# Altium project AdamPannel.PrjPcb
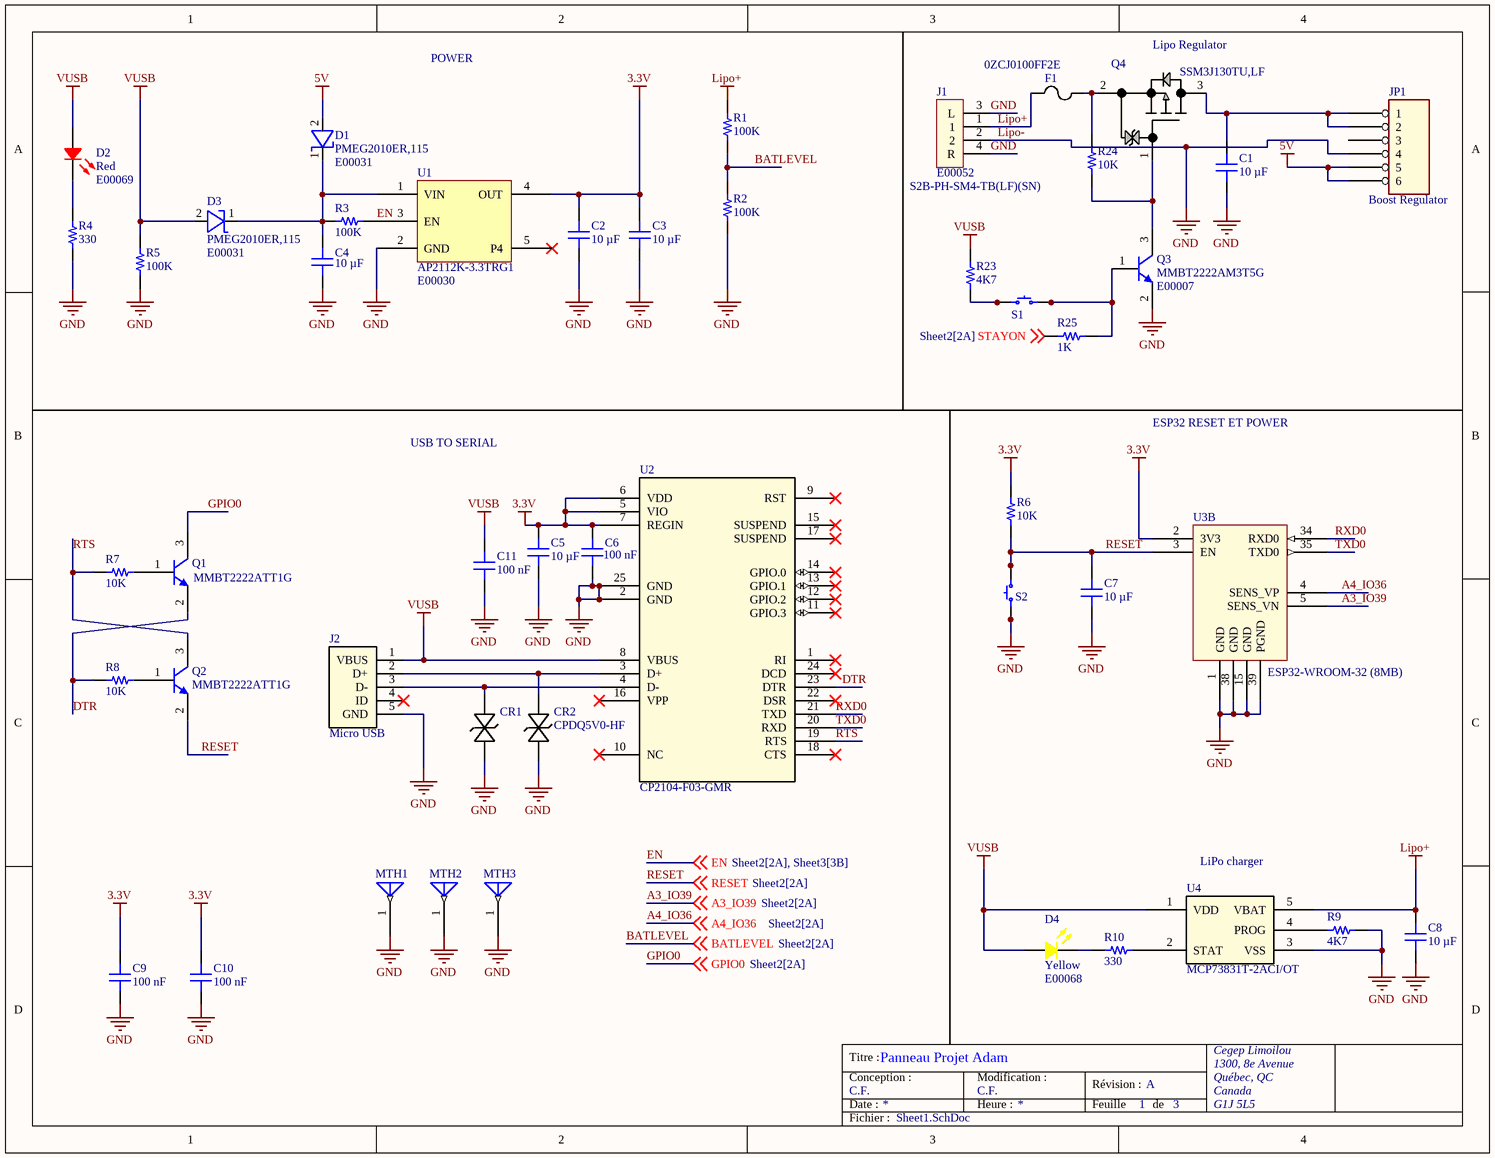
[diagram p0: Sheet1.SchDoc]
3 sheets, 89 parts. Net scope: global (net labels, ports and power ports of the same name join across sheets).
Board file: AdamPannel.PcbDoc
Sheets:
  Sheet1.SchDoc
  Sheet2.SchDoc
  Sheet3.SchDoc

## Sheet Sheet1.SchDoc: Panneau Projet Adam
size Letter; Author: Camille Fortin; CompanyName: Cegep Limoilou; Organization: Cegep Limoilou; Address1: 1300, 8e Avenue; Address2: Québec, QC; Address3: Canada; Address4: G1J 5L5; Revision: A; SheetNumber: 1; SheetTotal: 3; Conception: C.F.; Titre: Panneau Projet Adam; Modification: C.F.

### Parts
C1  10 µF  [CAP 0603]
C2  10 µF  [CAP 0603]
C3  10 µF  [CAP 0603]
C4  10 µF  [CAP 0603]
C5  10 µF  [CAP 0603]
C6  100 nF  [CAP 0603]
C7  10 µF  [CAP 0603]
C8  10 µF  [CAP 0603]
C9  100 nF  [CAP 0603]
C10  100 nF  [CAP 0603]
C11  100 nF  [CAP 0603]
CR1  CPDQ5V0-HF  [CPDQ-M]  (value not drawn)
CR2  CPDQ5V0-HF  [CPDQ-M]
D1  PMEG2010ER,115  ADAM Inventory Number 1: E00031  [DIODE_PMEG2010ER,115_NEX]
D2  Red  ADAM Inventory Number 1: E00069  [Red Led 0603]
D3  PMEG2010ER,115  ADAM Inventory Number 1: E00031  [DIODE_PMEG2010ER,115_NEX]
D4  Yellow  ADAM Inventory Number 1: E00068  [YELLOW LED 0603 - duplicate]
F1  0ZCJ0100FF2E  [Fuse 500mA 0.6mm]
J1  ADAM Inventory Number 1: E00052  Supplier Part Number 1: S2B-PH-SM4-TB(LF)(SN)  [S2B-PH-SM4-TB_LF__SN]  (hidden comment: CONN JST 2P SM 90DEG)
J2  Micro USB  [CONN_1050170001_MOL]
JP1  Boost Regulator  [HDR1X6]
MTH1  NTENNA  [Mounting Hole]  (value not drawn)
MTH2  ANTENNA  [Mounting Hole]  (value not drawn)
MTH3  ANTENNA  [Mounting Hole]  (value not drawn)
Q1  MMBT2222ATT1G  [SOT-416_1P65X0P9_ONS-M]
Q2  MMBT2222ATT1G  [SOT-416_1P65X0P9_ONS-M]
Q3  MMBT2222AM3T5G  ADAM Inventory Number 1: E00007  [SOT_4C-E3-08_VIS-M]
Q4  SSM3J130TU,LF  [UFM_TOS]
R1  100K  [RES 0603]
R2  100K  [RES 0603]
R3  100K  [RES 0603]
R4  330  [RES 0603]
R5  100K  [RES 0603]
R6  10K  [RES 0603]
R7  10K  [RES 0603]
R8  10K  [RES 0603]
R9  4K7  [RES 0603]
R10  330  [RES 0603]
R23  4K7  [RES 0603]
R24  10K  [RES 0603]
R25  1K  [RES 0603]
S1  KMR741NG ULC LFS  [Switch Lin SMD]  (value not drawn)
S2  KMR741NG ULC LFS  [Switch Lin SMD]  (value not drawn)
U1  AP2112K-3.3TRG1  ADAM Inventory Number 1: E00030  [AP2112R5-3.3TRG1_DIO]
U2  CP2104-F03-GMR  [QFN_F03-GMR_SIL-M]
U3  ESP32-WROOM-32 (8MB)  [ESP32-WROOM-32D]  (part B of 3)
U4  MCP73831T-2ACI/OT  [SOT23_MCP73831T-2ACI/OT_HNW]

### Nets
3.3V: C2.2 C3.2 C5.2 C6.2 C9.2 C10.2 R6.2 U1.4(OUT) U2.5(VIO) U2.6(VDD) U2.7(REGIN) U3.2(3V3)
5V: D1.2(A) JP1.5 JP1.6
GND: C1.1 C2.1 C3.1 C4.1 C5.1 C6.1 C7.1 C8.1 C9.1 C10.1 C11.1 CR1.1 CR2.1 J1.2 J1.3(L) J1.4(R) J2.5(GND) JP1.4 MTH1.1 MTH2.1 MTH3.1 Q3.2(E) R2.1 R4.2 R5.1 R9.2 S2.1 S2.2 U1.2(GND) U2.2(GND) U2.25(GND) U3.1(GND) U3.15(GND) U3.38(GND) U3.39(PGND) U4.3(VSS)  [also labelled Lipo-]
Lipo+: C8.2 F1.1 J1.1 R1.2 U4.5(VBAT)
VUSB: C11.2 D2.1 D3.2(A) D4.1 J2.1(VBUS) R5.2 R23.2 U2.8(VBUS) U4.1(VDD)
A3_IO39: U3.5(SENS_VN) ; off-sheet A3_IO39
A4_IO36: U3.4(SENS_VP) ; off-sheet A4_IO36
BATLEVEL: R1.1 R2.2 ; off-sheet BATLEVEL
DTR: Q1.2(E) R8.2 U2.23(DTR)
EN: R3.1 U1.3(EN) ; off-sheet EN
GPIO0: Q1.3(C) ; off-sheet GPIO0
RESET: C7.2 Q2.2(E) R6.1 S2.3 S2.4 U3.3(EN) ; off-sheet RESET
RTS: Q2.3(C) R7.2 U2.19(RTS)
RXD0: U2.21(TXD) U3.34(RXD0)
STAYON: R25.2 ; off-sheet STAYON
TXD0: U2.20(RXD) U3.35(TXD0)
NetC1_2: C1.2 JP1.1 JP1.2 Q4.3
NetC4_2: C4.2 D1.1(K) D3.1(K) R3.2 U1.1(VIN)
NetCR1_2: CR1.2 J2.3(D-) U2.4(D-)
NetCR2_2: CR2.2 J2.2(D+) U2.3(D+)
NetD2_2: D2.2 R4.1
NetD4_2: D4.2 R10.1
NetF1_2: F1.2 Q4.2 R24.2
NetQ1_1: Q1.1(B) R7.1
NetQ2_1: Q2.1(B) R8.1
NetQ3_1: Q3.1(B) R25.1 S1.3 S1.4
NetQ3_3: Q3.3(C) Q4.1 R24.1
NetR9_1: R9.1 U4.4(PROG)
NetR10_2: R10.2 U4.2(STAT)
NetR23_1: R23.1 S1.1 S1.2

Not connected (* = marked no-connect by the designer): J2 4(ID)*; JP1 3; U1 5(P4)*; U2 1(RI)* 9(RST)* 10(NC)* 11(GPIO.3)* 12(GPIO.2)* 13(GPIO.1)* 14(GPIO.0)* 15(SUSPEND)* 16(VPP)* 17(SUSPEND)* 18(CTS)* 22(DSR)* 24(DCD)*

### Notes on the sheet
- POWER
- (near Q4) Lipo Regulator
- ESP32 RESET ET POWER
- USB TO SERIAL
- (near U4) LiPo charger
- Titre :
- Conception :
- Date :
- Modification :
- Heure :
- Révision :
- Feuille
- de
- Fichier :

### Library data of the parts
C1-C5 C7 C8 = GRM188C81A106MA73D: CAP CER 10UF 10V X6S 0603; manufacturer: Murata Electronics; Tolerance: ±20%; Part Number: GRM188C81A106MA73D; Value: 10 µF; Applications: General Purpose; Capacitance: 10 µF; componentlink1description: Datasheet; componentlink1url: https://www.murata.com/~/media/webrenewal/support/library/catalog/products/capacitor/mlcc/c02e.ashx?la=en-us; componentlink2description: DigiKey Link; componentlink2url: https://www.digikey.com/en/products/detail/murata-electronics/GRM188C81A106MA73D/3900461; Device Package: 0603 (1608 Metric); lastupdated: 2023-03-27 19:07:26; Lifecycle Status: Active; Minimum Order: 1; Mounting Type: Surface Mount, MLCC; Operating Temperature: -55°C ~ 105°C; Package / Case: 0603 (1608 Metric); packaging: TapeAndReel; partid: 2456; Part Status: Active; price: 0.04; series: GRM; Size / Dimension: 0.063" L x 0.031" W (1.60mm x 0.80mm); Supplier 1: DigiKey; Supplier Part Number 1: 490-7197-1-ND; Temperature Coefficient: X6S; Thickness (Max): 0.039" (1.00mm); Voltage - Rated: 10V; Manufacturer Part Number 1: GRM188C81A106MA73D
C6 C9-C11 = GRM188C81A106MA73D: CAP CER 10UF 10V X6S 0603; manufacturer: Murata Electronics; Capacitance: 10 µF; Tolerance: ±20%; Part Number: GRM188C81A106MA73D; Value: 100 nF; Applications: General Purpose; componentlink1description: Datasheet; componentlink1url: https://www.murata.com/~/media/webrenewal/support/library/catalog/products/capacitor/mlcc/c02e.ashx?la=en-us; componentlink2description: DigiKey Link; componentlink2url: https://www.digikey.com/en/products/detail/murata-electronics/GRM188C81A106MA73D/3900461; Device Package: 0603 (1608 Metric); lastupdated: 2023-03-27 19:07:26; Lifecycle Status: Active; Minimum Order: 1; Mounting Type: Surface Mount, MLCC; Operating Temperature: -55°C ~ 105°C; Package / Case: 0603 (1608 Metric); packaging: TapeAndReel; partid: 2456; Part Status: Active; price: 0.04; series: GRM; Size / Dimension: 0.063" L x 0.031" W (1.60mm x 0.80mm); Supplier 1: DigiKey; Supplier Part Number 1: 490-7197-1-ND; Temperature Coefficient: X6S; Thickness (Max): 0.039" (1.00mm); Voltage - Rated: 10V; Manufacturer Part Number 1: GRM188C81A106MA73D
CR1 CR2 = CPDQ5V0-HF: Diode TVS bidirectionnel; Mfr_Name: Comchip
D1 D3 = PMEG2010ER,115: Diode shotkey; Manufacturer Part Number 1: PMEG2010ER115; Supplier 1: Digi-Key; Supplier Part Number 1: 1727-5192-1-ND
D2 = 0603 RED LED: Manufacturer Part Number 1: BL-HUB36A-AV-TRB; Manufacturer: American Bright Optoelectronics Corporation; Configuration: Standard; Current - Test: 20mA; Lens Color: Colorless; Lens Style: Rectangle with Flat Top; Lens Transparency: Clear; Millicandela Rating: 94mcd; Viewing Angle: 120°; Voltage - Forward (Vf) (Typ): 2.2V; Wavelength - Dominant: 632nm; Wavelength - Peak: 645nm; Color: Red; ComponentLink1Description: Datasheet; ComponentLink1URL: https://americanbrightled.com/pdffiles/smt/BL-HUB36A-AV-TRB.pdf; ComponentLink2Description: DigiKey Link; ComponentLink2URL: https://www.digikey.com/en/products/detail/american-bright-optoelectronics-corporation/BL-HUB36A-AV-TRB/9678174; Device Package: 0603 (1608 Metric); Height (Max): 0.70mm; LastUpdated: 2023-03-27 19:53:19; Lifecycle Status: Active; Minimum Order: 1; Mounting Type: Surface Mount; Package / Case: 0603 (1608 Metric); Packaging: TapeAndReel; PartId: 1020; Part Status: Active; Price: 0.04; Series: -; Size / Dimension: 1.60mm L x 0.80mm W; Supplier 1: DigiKey; Supplier Part Number 1: BL-HUB36A-AV-TRBCT-ND; Supplier Device Package: 0603; Value: Red
D4 = 0603 YELLOW LED: 0603 YELLOW; Manufacturer Part Number 1: BL-HKC36D-AV-TRB; Manufacturer: American Bright Optoelectronics Corporation; Configuration: 0603; Current - Test: 20mA; Lens Color: Colorless; Lens Size: 0.87mm x 0.80mm; Lens Style: Rectangle with Flat Top; Lens Transparency: Clear; Millicandela Rating: 120mcd; Viewing Angle: 120°; Voltage - Forward (Vf) (Typ): 2V; Wavelength - Dominant: 589nm; Wavelength - Peak: 590nm; Color: Yellow; ComponentLink1Description: Datasheet; ComponentLink1URL: http://americanbrightled.com/pdffiles/smt/BL-HKC36D-AV-TRB.pdf; ComponentLink2Description: DigiKey Link; ComponentLink2URL: https://www.digikey.com/en/products/detail/american-bright-optoelectronics-corporation/BL-HKC36D-AV-TRB/9678175; Device Package: 0603 (1608 Metric); Height (Max): 0.85mm; LastUpdated: 2023-03-27 19:54:01; Lifecycle Status: Active; Minimum Order: 1; Mounting Type: Surface Mount; Package / Case: 0603 (1608 Metric); Packaging: TapeAndReel; PartId: 82; Part Status: Active; Price: 0.04; Series: -; Size / Dimension: 1.60mm L x 0.80mm W; Supplier 1: DigiKey; Supplier Part Number 1: BL-HKC36D-AV-TRBCT-ND; Supplier Device Package: 0603; Value: Yellow
F1 = NANOSMDCH030F/24-02: No Description Available; Mfr_Name: Littelfuse Inc
J1 = CONN JST 2P SM 90DEG: CONN SM JST 2P; Copyright: Copyright (C) 2023 Ultra Librarian. All rights reserved.; Mfr_Name: JST; Manufacturer Part Number 1: S2B-PH-SM4-TB(LF)(SN); RefDes: RefDes; Type: DEV; Supplier 1: Arrow Electronics; Parameter 1: *
J2 = 1050170001: No Description Available; Mfr_Name: Molex Connector Corporation; Copyright: Copyright (C) 2023 Ultra Librarian. All rights reserved.; RefDes: RefDes; Type: DEV; Manufacturer Part Number 1: 1050170001
JP1 = HEADER 6
MTH1 = ANTENNA
Q1 Q2 = MMBT2222ATT1G: TRANS NPN 40V 0.6A SC75-3; Manufacturer: ON Semiconductor; Current - Collector (Ic) (Max): 600mA; DC Current Gain (hFE) (Min) @ Ic, Vce: 100 @ 150mA, 10V; Frequency - Transition: 300MHz; Power - Max: 150mW; Vce Saturation (Max) @ Ib, Ic: 1V @ 50mA, 500mA; Part Number: MMBT2222ATT1G; ComponentLink1Description: Datasheet; ComponentLink1URL: http://www.onsemi.com/pub/Collateral/MMBT2222ATT1-D.PDF; ComponentLink2Description: DigiKey Link; ComponentLink2URL: http://digikey.com/product-detail/en/on-semiconductor/MMBT2222ATT1G/MMBT2222ATT1GOSCT-ND/1967146; LastUpdated: 2023-03-27 20:07:05; Lifecycle Status: Active; Minimum Order: 1; Mounting Type: Surface Mount; Operating Temperature: -55°C ~ 150°C (TJ); Package / Case: SC-75, SOT-416; Packaging: TapeAndReel; PartId: 32; Part Status: Active; Price: 0.02; Series: -; Supplier 1: DigiKey; Supplier Part Number 1: MMBT2222ATT1GOSCT-ND; Supplier Device Package: SC-75, SOT-416; Transistor Type: NPN; Voltage - Collector Emitter Breakdown (Max): 40V; Manufacturer Part Number 1: MMBT2222ATT1G
Q3 = TRANS NPN 40V: TRANS NPN 40V 0.6A SOT-723; Manufacturer: ON Semiconductor; Current - Collector Cutoff (Max): 10nA (ICBO); Current - Collector (Ic) (Max): 600mA; DC Current Gain (hFE) (Min) @ Ic, Vce: 100 @ 150mA, 10V; Frequency - Transition: 300MHz; Power - Max: 640mW; Vce Saturation (Max) @ Ib, Ic: 1V @ 50mA, 500mA; Manufacturer Part Number 1: MMBT2222AM3T5G; ComponentLink1Description: Datasheet; ComponentLink1URL: http://www.onsemi.com/pub/Collateral/MMBT2222AM3-D.PDF; ComponentLink2Description: DigiKey Link; ComponentLink2URL: http://digikey.com/product-detail/en/on-semiconductor/MMBT2222AM3T5G/MMBT2222AM3T5GOSCT-ND/3487571; LastUpdated: 2023-03-28 20:16:11; Lifecycle Status: Active; Minimum Order: 1; Mounting Type: Surface Mount; Operating Temperature: -55°C ~ 150°C (TJ); Package / Case: SOT-723; Packaging: TapeAndReel; PartId: 22; Part Status: Active; Price: 0.03; Series: -; Supplier 1: DigiKey; Supplier Part Number 1: MMBT2222AM3T5GOSCT-ND; Supplier Device Package: SOT-723; Transistor Type: NPN; Voltage - Collector Emitter Breakdown (Max): 40V
Q4 = SSM3J130TU,LF: No Description Available; Mfr_Name: Toshiba Electronic Devices & Storage Corp.; RefDes: Refdes; Type: Type
R1-R3 R5 R23-R25 = CPF0603B100KE: RES SMD 100K OHM 0.1% 1/16W 0603; Manufacturer: TE Connectivity Passive Product; Power (Watts): 0.063W, 1/16W; Resistance: 100 kOhms; Temperature Coefficient: ±25ppm/°C; Part Number: CPF0603B100KE; ComponentLink1Description: Datasheet; ComponentLink1URL: https://www.te.com/commerce/DocumentDelivery/DDEController?Action=srchrtrv&DocNm=1773200&DocType=DS&DocLang=English; ComponentLink2Description: DigiKey Link; ComponentLink2URL: https://www.digikey.com/en/products/detail/te-connectivity-passive-product/CPF0603B100KE/2381864; Composition: Thin Film; Device Package: 0603 (1608 Metric); Height - Seated (Max): 0.022" (0.55mm); LastUpdated: 2023-03-22 19:30:13; Lifecycle Status: Active; Minimum Order: 1; Number of Terminations: 2; Operating Temperature: -55°C ~ 155°C; Package / Case: 0603 (1608 Metric); Packaging: TapeAndReel; PartId: 4883; Part Status: Active; Price: 0.09; Series: CPF, Neohm; Size / Dimension: 0.061" L x 0.031" W (1.55mm x 0.80mm); Supplier 1: DigiKey; Supplier Part Number 1: A119912CT-ND; Supplier Device Package: 0603; Tolerance: ±0.1%; Manufacturer Part Number 1: CPF0603B100KE
  R1-R3 R5: Value: 100K
  R23: Value: 4K7
  R24: Value: 10K
  R25: Value: 1K
R4 R10 = CPF0603B1K0E: RES SMD 1K OHM 0.1% 1/16W 0603; Manufacturer: TE Connectivity Passive Product; Power (Watts): 0.063W, 1/16W; Resistance: 1 kOhms; Temperature Coefficient: ±25ppm/°C; Part Number: CPF0603B1K0E; Value: 330; ComponentLink1Description: Datasheet; ComponentLink1URL: https://www.te.com/commerce/DocumentDelivery/DDEController?Action=srchrtrv&DocNm=1773200&DocType=DS&DocLang=English; ComponentLink2Description: DigiKey Link; ComponentLink2URL: https://www.digikey.com/en/products/detail/te-connectivity-passive-product/CPF0603B1K0E/2390473; Composition: Thin Film; Device Package: 0603 (1608 Metric); Height - Seated (Max): 0.022" (0.55mm); LastUpdated: 2023-03-28 19:30:06; Lifecycle Status: Active; Minimum Order: 1; Number of Terminations: 2; Operating Temperature: -55°C ~ 155°C; Package / Case: 0603 (1608 Metric); Packaging: TapeAndReel; PartId: 4877; Part Status: Active; Price: 0.09; Series: CPF, Neohm; Size / Dimension: 0.061" L x 0.031" W (1.55mm x 0.80mm); Supplier 1: DigiKey; Supplier Part Number 1: A119887CT-ND; Supplier Device Package: 0603; Tolerance: ±0.1%; Manufacturer Part Number 1: CPF0603B1K0E
R6-R8 = RNCS0603BKE10K0: RES 10K OHM 0.1% 1/16W 0603; Manufacturer: Stackpole Electronics Inc; Power (Watts): 0.063W, 1/16W; Resistance: 10 kOhms; Temperature Coefficient: ±25ppm/°C; Part Number: RNCS0603BKE10K0; Value: 10K; ComponentLink1Description: Datasheet; ComponentLink1URL: https://www.seielect.com/catalog/sei-rncs_rnch.pdf; ComponentLink2Description: DigiKey Link; ComponentLink2URL: https://www.digikey.com/en/products/detail/stackpole-electronics-inc/RNCS0603BKE10K0/1708836; Composition: Thin Film; Device Package: 0603 (1608 Metric); Features: Anti-Corrosive, Automotive AEC-Q200, Moisture Resistant; Height - Seated (Max): 0.022" (0.55mm); LastUpdated: 2023-03-27 19:26:50; Lifecycle Status: Active; Minimum Order: 1; Number of Terminations: 2; Operating Temperature: -55°C ~ 155°C; Package / Case: 0603 (1608 Metric); Packaging: TapeAndReel; PartId: 4838; Part Status: Active; Price: 0.07; Ratings: AEC-Q200; Series: RNCS; Size / Dimension: 0.061" L x 0.031" W (1.55mm x 0.80mm); Supplier 1: DigiKey; Supplier Part Number 1: RNCS0603BKE10K0CT-ND; Supplier Device Package: 0603; Tolerance: ±0.1%; Manufacturer Part Number 1: RNCS0603BKE10K0
R9 = RT0603FRE074K7L: RES SMD 4.7K OHM 1% 1/10W 0603; Manufacturer: Yageo; Power (Watts): 0.1W, 1/10W; Resistance: 4.7 kOhms; Temperature Coefficient: ±50ppm/°C; Part Number: RT0603FRE074K7L; Value: 4K7; ComponentLink1Description: Datasheet; ComponentLink1URL: https://www.yageo.com/upload/media/product/productsearch/datasheet/rchip/PYu-RT_1-to-0.01_RoHS_L_11.pdf; ComponentLink2Description: DigiKey Link; ComponentLink2URL: https://www.digikey.com/en/products/detail/yageo/RT0603FRE074K7L/1075404; Composition: Thin Film; Device Package: 0603 (1608 Metric); Height - Seated (Max): 0.022" (0.55mm); LastUpdated: 2023-03-28 19:30:03; Lifecycle Status: Active; Minimum Order: 1; Number of Terminations: 2; Operating Temperature: -55°C ~ 155°C; Package / Case: 0603 (1608 Metric); Packaging: TapeAndReel; PartId: 5678; Part Status: Active; Price: 0.01; Series: RT; Size / Dimension: 0.063" L x 0.031" W (1.60mm x 0.80mm); Supplier 1: DigiKey; Supplier Part Number 1: YAG1238CT-ND; Supplier Device Package: 0603; Tolerance: ±1%; Manufacturer Part Number 1: RT0603FRE074K7L
S1 S2 = KMR741NG ULC LFS: SWITCH TACTILE SPST-NO 50MA 32V; Manufacturer: C&K; Actuator Height off PCB, Vertical: 2.50mm; Actuator Orientation: Top Actuated; Actuator Type: Standard; Contact Rating @ Voltage: 0.05A @ 32VDC; Illumination: Non-Illuminated; Ingress Protection: IP67 - Dust Tight, Waterproof; Operating Force: 400gf; Outline: 4.20mm x 2.80mm; Switch Function: Off-Mom; Part Number: KMR741NG ULC LFS; Circuit: SPST-NO; ComponentLink1Description: Datasheet; ComponentLink1URL: https://dznh3ojzb2azq.cloudfront.net/products/Tactile/KMR7/documents/datasheet.pdf; ComponentLink2Description: DigiKey Link; ComponentLink2URL: http://digikey.com/product-detail/en/c-k/KMR741NG-ULC-LFS/CKN10688CT-ND/6035360; LastUpdated: 2020-04-09 10:01:05; Lifecycle Status: Active; Minimum Order: 1; Mounting Type: Surface Mount; Operating Temperature: -40°C ~ 85°C; Packaging: TapeAndReel; Part Status: Active; Price: 0.16; Series: KMR7; Supplier 1: DigiKey; Supplier Part Number 1: CKN10688CT-ND; Termination Style: Gull Wing; Manufacturer Part Number 1: KMR741NG ULC LFS
U1 = REG LIN 3.3V: REG LINEAIRE 3.3V; Manufacturer Part Number 1: AP2112K-3.3TRG1; Supplier 1: Future Electronics; Supplier Part Number 1: 8043011
U2 = CP2104-F03-GMR: No Description Available; Mfr_Name: Silicon Labs; Copyright: Copyright (C) 2023 Ultra Librarian. All rights reserved.; RefDes: RefDes; Type: DEV; Manufacturer Part Number 1: CP2104-F03-GMR
U3 = ESP32-WROOM-32 (8MB): No Description Available; Mfr_Name: Espressif Systems; Copyright: Copyright (C) 2023 Ultra Librarian. All rights reserved.; RefDes: RefDes; Type: DEV; Manufacturer Part Number 1: ESP32-WROOM-32 (8MB)
U4 = MCP73831T-2ACI/OT: No Description Available; Mfr_Name: Honeywell; Copyright: Copyright (C) 2023 Ultra Librarian. All rights reserved.; RefDes: RefDes; Type: DEV; Manufacturer Part Number 1: MCP73831T-2ACI/OT

## Sheet Sheet2.SchDoc
size Letter; Author: Camille Fortin; CompanyName: Cégep Limoilou; Organization: Cegep Limoilou; Address1: 1300, 8e Avenue; Address2: Québec, QC; Address3: Canada; Address4: G1J 5L5; Revision: A; SheetNumber: 2; SheetTotal: 3; Conception: C.F.; Titre: Panneau Projet Adam; Modification: C.F.
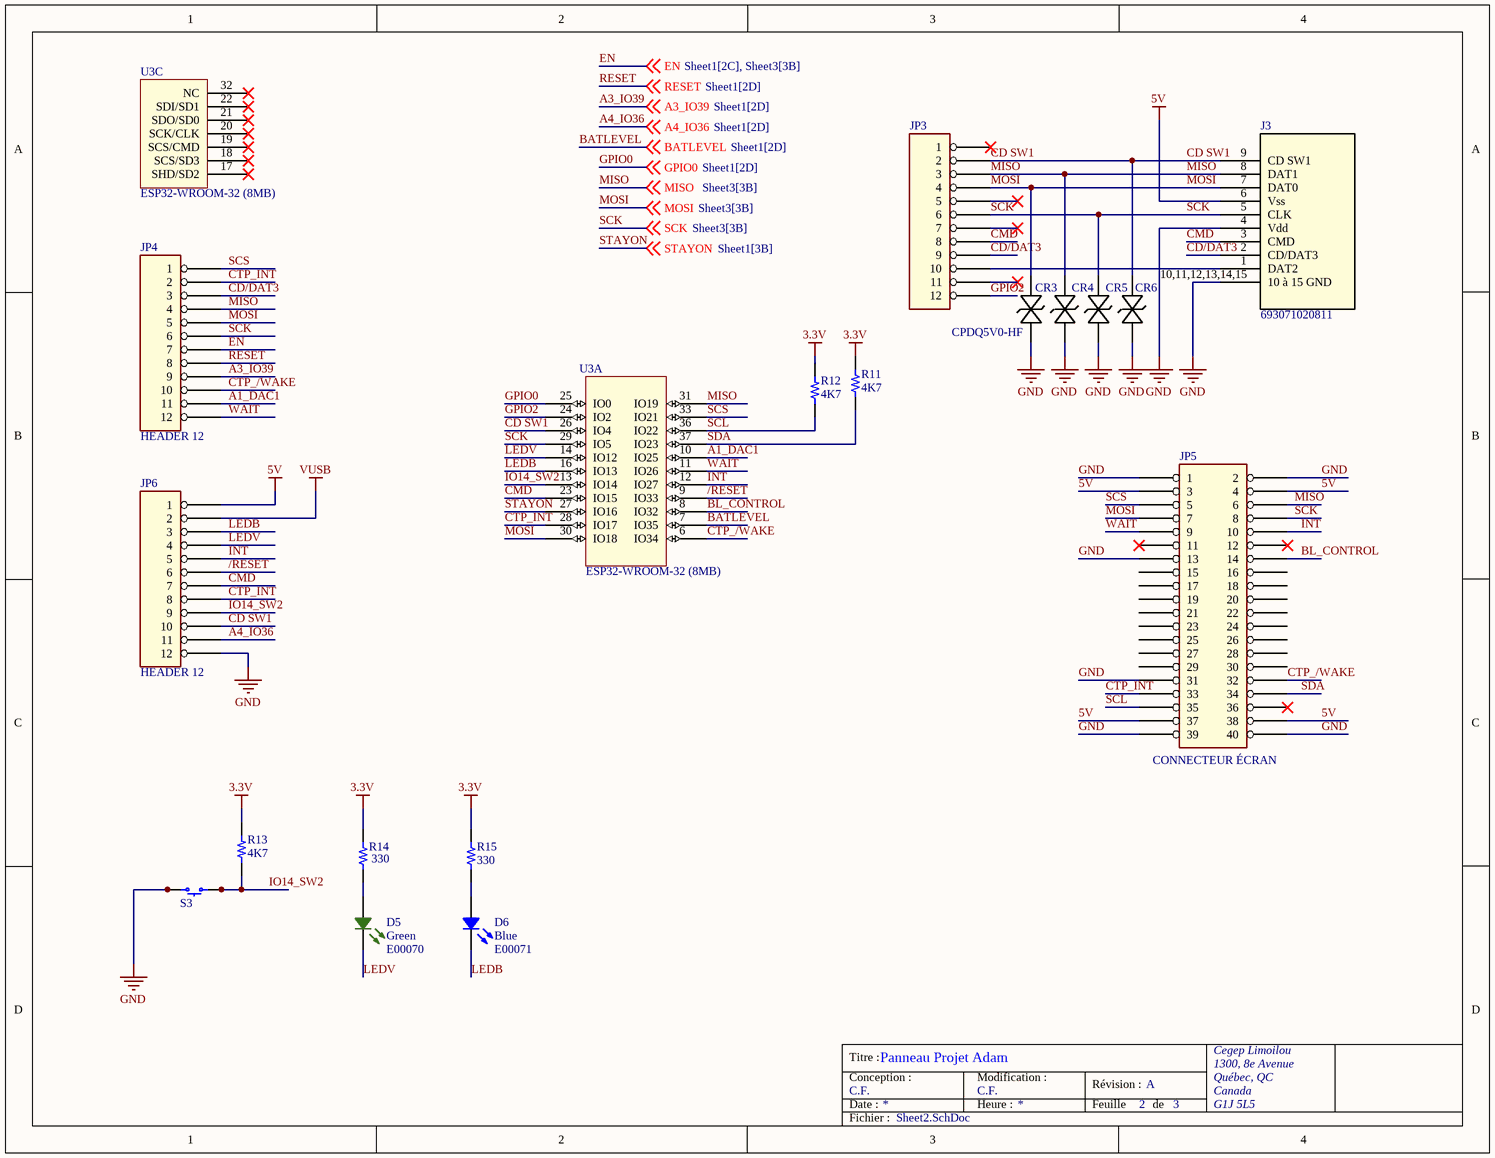
[diagram p1: Sheet2.SchDoc]

### Parts
CR3  CPDQ5V0-HF  [CPDQ-M]
CR4  CPDQ5V0-HF  [CPDQ-M]  (value not drawn)
CR5  CPDQ5V0-HF  [CPDQ-M]  (value not drawn)
CR6  CPDQ5V0-HF  [CPDQ-M]  (value not drawn)
D5  Green  ADAM Inventory Number 1: E00070  [Green LED 0603]
D6  Blue  ADAM Inventory Number 1: E00071  [Blue LED 0603]
J3  693071020811  [CONN9_020811_WRE]
JP3  HEADER 12  [CONN 12PIN FEMALE]  (value not drawn)
JP4  HEADER 12  [CONN 12PIN FEMALE]
JP5  CONNECTEUR ÉCRAN  [J\40P]
JP6  HEADER 12  [CONN 12PIN FEMALE]
R11  4K7  [RES 0603]
R12  4K7  [RES 0603]
R13  4K7  [RES 0603]
R14  330  [RES 0603]
R15  330  [RES 0603]
S3  KMR741NG ULC LFS  [Switch Lin SMD]  (value not drawn)
U3  ESP32-WROOM-32 (8MB)  [ESP32-WROOM-32D]  (parts A,C of 3)

### Nets
3.3V: R11.2 R12.2 R13.2 R14.2 R15.2
5V: J3.6(Vss) JP5.3 JP5.4 JP5.37 JP5.38 JP6.1
GND: CR3.1 CR4.1 CR5.1 CR6.1 J3.4(Vdd) J3.10,11,12,13,14,15(10_à_15_GND) JP5.1 JP5.2 JP5.13 JP5.31 JP5.39 JP5.40 JP6.12 S3.3 S3.4
VUSB: JP6.2
/RESET: JP6.6 U3.9(IO33)
A1_DAC1: JP4.11 U3.10(IO25)
A3_IO39: JP4.9 ; off-sheet A3_IO39
A4_IO36: JP6.11 ; off-sheet A4_IO36
BATLEVEL: U3.7(IO35) ; off-sheet BATLEVEL
BL_CONTROL: JP5.14 U3.8(IO32)
CD SW1: CR6.2 J3.9(CD_SW1) JP3.2 JP6.10 U3.26(IO4)
CD/DAT3: J3.2(CD/DAT3) JP3.9 JP4.3
CMD: J3.3(CMD) JP3.8 JP6.7 U3.23(IO15)
CTP_/WAKE: JP4.10 JP5.32 U3.6(IO34)
CTP_INT: JP4.2 JP5.33 JP6.8 U3.28(IO17)
EN: JP4.7 ; off-sheet EN
GPIO0: U3.25(IO0) ; off-sheet GPIO0
GPIO2: JP3.12 U3.24(IO2)
INT: JP5.10 JP6.5 U3.12(IO27)
IO14_SW2: JP6.9 R13.1 S3.1 S3.2 U3.13(IO14)
LEDB: D6.2 JP6.3 U3.16(IO13)
LEDV: D5.2 JP6.4 U3.14(IO12)
MISO: CR4.2 J3.8(DAT1) JP3.3 JP4.4 JP5.6 U3.31(IO19) ; off-sheet MISO
MOSI: CR3.2 J3.7(DAT0) JP3.4 JP4.5 JP5.7 U3.30(IO18) ; off-sheet MOSI
RESET: JP4.8 ; off-sheet RESET
SCK: CR5.2 J3.5(CLK) JP3.6 JP4.6 JP5.8 U3.29(IO5) ; off-sheet SCK
SCL: JP5.35 R12.1 U3.36(IO22)
SCS: JP4.1 JP5.5 U3.33(IO21)
SDA: JP5.34 R11.1 U3.37(IO23)
STAYON: U3.27(IO16) ; off-sheet STAYON
WAIT: JP4.12 JP5.9 U3.11(IO26)
NetD5_1: D5.1 R14.1
NetD6_1: D6.1 R15.1
NetJ3_1: J3.1(DAT2) JP3.10

Not connected (* = marked no-connect by the designer): JP3 1* 5* 7* 11*; JP5 11* 12* 15 16 17 18 19 20 21 22 23 24 25 26 27 28 29 30 36*; U3 17(SHD/SD2)* 18(SCS/SD3)* 19(SCS/CMD)* 20(SCK/CLK)* 21(SDO/SD0)* 22(SDI/SD1)* 32(NC)*

### Notes on the sheet
- Titre :
- Conception :
- Date :
- Modification :
- Heure :
- Révision :
- Feuille
- de
- Fichier :

### Library data of the parts
CR3-CR6 = CPDQ5V0-HF: as CR1 on sheet Sheet1
D5 = 0603 GREEN LED: LED GREEN 0603 SMD; Manufacturer Part Number 1: 5973316507F; Manufacturer: Dialight; Configuration: Standard; Current - Test: 20mA; Lens Color: 1.24mm; Lens Style: Round with Domed Top; Millicandela Rating: 34mcd; Voltage - Forward (Vf) (Typ): 2V; Wavelength - Dominant: 560nm; Color: Green; ComponentLink1Description: Datasheet; ComponentLink1URL: http://www.dialightsignalsandcomponents.com/Assets/Drawings/2D_Drawings_DrawingDetailedSpec/NewDrawings/C18371C.pdf; ComponentLink2Description: DigiKey Link; ComponentLink2URL: https://www.digikey.com/en/products/detail/dialight/5973316507F/9385428; Device Package: 0603 (1608 Metric); Height (Max): 1.24mm; LastUpdated: 2023-03-27 19:52:49; Lifecycle Status: Active; Minimum Order: 1; Mounting Type: Surface Mount; Package / Case: 0603 (1608 Metric); Packaging: TapeAndReel; PartId: 587; Part Status: Active; Price: 0.13; Series: 597; Size / Dimension: 1.60mm L x 0.80mm W; Supplier 1: DigiKey; Supplier Part Number 1: 350-4373-1-ND; Supplier Device Package: 0603; Value: Green
D6 = 0603 BLUE LED: Blue 470nm LED Indication - Discrete 3.3V 0603 (1608 Metric); Manufacturer Part Number 1: APT1608LVBC/D; Supplier 1: Digi-Key; Supplier Part Number 1: 754-1933-1-ND
J3 = 693071020811: No Description Available; Mfr_Name: Wurth Electronics; Copyright: Copyright (C) 2023 Ultra Librarian. All rights reserved.; RefDes: RefDes; Type: DEV; Manufacturer Part Number 1: 693071020811
JP5 = HEADER 20X2
R11-R13 = RT0603FRE074K7L: as R9 on sheet Sheet1; Part Number: RT0603FRE074K7L; Value: 4K7; ComponentLink1Description: Datasheet; ComponentLink1URL: https://www.yageo.com/upload/media/product/productsearch/datasheet/rchip/PYu-RT_1-to-0.01_RoHS_L_11.pdf; ComponentLink2Description: DigiKey Link; ComponentLink2URL: https://www.digikey.com/en/products/detail/yageo/RT0603FRE074K7L/1075404; Composition: Thin Film; Device Package: 0603 (1608 Metric); Height - Seated (Max): 0.022" (0.55mm); LastUpdated: 2023-03-28 19:30:03; Lifecycle Status: Active; Minimum Order: 1; Number of Terminations: 2; Operating Temperature: -55°C ~ 155°C; Package / Case: 0603 (1608 Metric); Packaging: TapeAndReel; PartId: 5678; Part Status: Active; Price: 0.01; Series: RT; Size / Dimension: 0.063" L x 0.031" W (1.60mm x 0.80mm); Supplier 1: DigiKey; Supplier Part Number 1: YAG1238CT-ND; Supplier Device Package: 0603; Tolerance: ±1%; Manufacturer Part Number 1: RT0603FRE074K7L
R14 R15 = CPF0603B1K0E: as R4 on sheet Sheet1; Part Number: CPF0603B1K0E; Value: 330; ComponentLink1Description: Datasheet; ComponentLink1URL: https://www.te.com/commerce/DocumentDelivery/DDEController?Action=srchrtrv&DocNm=1773200&DocType=DS&DocLang=English; ComponentLink2Description: DigiKey Link; ComponentLink2URL: https://www.digikey.com/en/products/detail/te-connectivity-passive-product/CPF0603B1K0E/2390473; Composition: Thin Film; Device Package: 0603 (1608 Metric); Height - Seated (Max): 0.022" (0.55mm); LastUpdated: 2023-03-28 19:30:06; Lifecycle Status: Active; Minimum Order: 1; Number of Terminations: 2; Operating Temperature: -55°C ~ 155°C; Package / Case: 0603 (1608 Metric); Packaging: TapeAndReel; PartId: 4877; Part Status: Active; Price: 0.09; Series: CPF, Neohm; Size / Dimension: 0.061" L x 0.031" W (1.55mm x 0.80mm); Supplier 1: DigiKey; Supplier Part Number 1: A119887CT-ND; Supplier Device Package: 0603; Tolerance: ±0.1%; Manufacturer Part Number 1: CPF0603B1K0E
S3 = KMR741NG ULC LFS: as S1 on sheet Sheet1; Part Number: KMR741NG ULC LFS; Circuit: SPST-NO; ComponentLink1Description: Datasheet; ComponentLink1URL: https://dznh3ojzb2azq.cloudfront.net/products/Tactile/KMR7/documents/datasheet.pdf; ComponentLink2Description: DigiKey Link; ComponentLink2URL: http://digikey.com/product-detail/en/c-k/KMR741NG-ULC-LFS/CKN10688CT-ND/6035360; LastUpdated: 2020-04-09 10:01:05; Lifecycle Status: Active; Minimum Order: 1; Mounting Type: Surface Mount; Operating Temperature: -40°C ~ 85°C; Packaging: TapeAndReel; Part Status: Active; Price: 0.16; Series: KMR7; Supplier 1: DigiKey; Supplier Part Number 1: CKN10688CT-ND; Termination Style: Gull Wing; Manufacturer Part Number 1: KMR741NG ULC LFS
U3 = ESP32-WROOM-32 (8MB): as U3 on sheet Sheet1; Copyright: Copyright (C) 2023 Ultra Librarian. All rights reserved.; RefDes: RefDes; Type: DEV; Manufacturer Part Number 1: ESP32-WROOM-32 (8MB)

## Sheet Sheet3.SchDoc
size Letter; Author: C.F.; DrawnBy: Camille Fortin; Organization: Cegep Limoilou; Address1: 1300, 8e Avenue; Address2: Québec, QC; Address3: Canada; Address4: G1J 5L5; Revision: A; SheetNumber: 3; SheetTotal: 3; Conception: Camillle Fortin; Titre: Panneau Projet Adam; Modification: C.F.
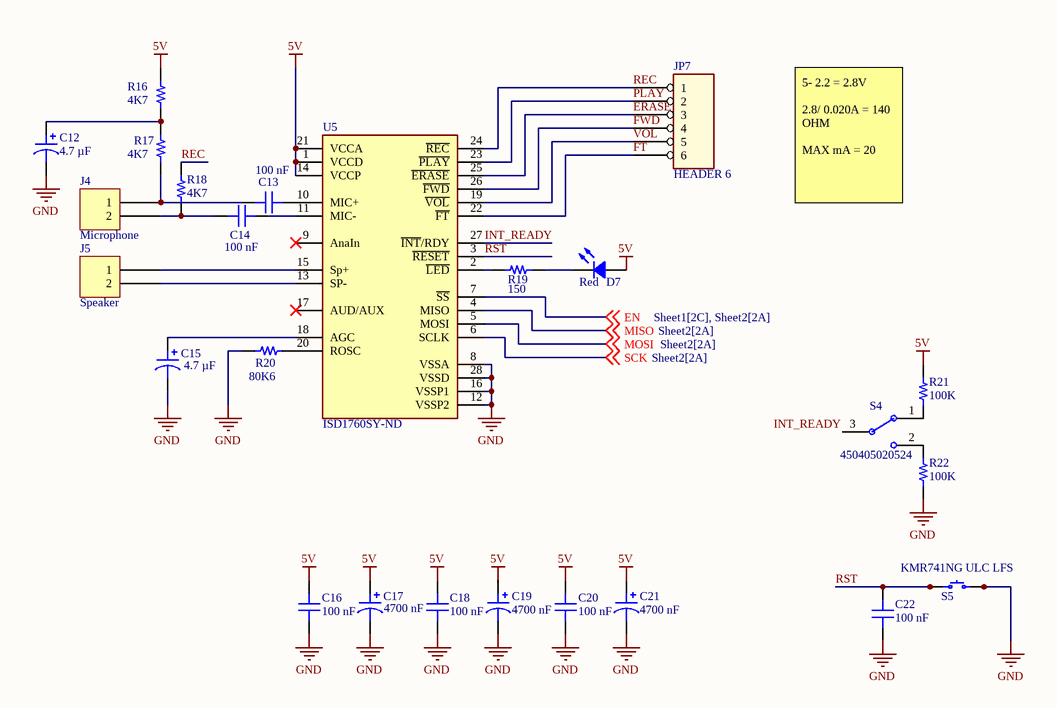
[diagram p2: Sheet3.SchDoc]

### Parts
C12  4.7 µF  [CAP ALUM 4.3MM2]
C13  100 nF  [CAP 0603]
C14  100 nF  [CAP 0603]
C15  4.7 µF  [CAP ALUM 4.3MM2]
C16  100 nF  [CAP 0603]
C17  4700 nF  [CAP ALSMD ELEC 4.3MM H5.4MM]
C18  100 nF  [CAP 0603]
C19  4700 nF  [CAP ALSMD ELEC 4.3MM H5.4MM]
C20  100 nF  [CAP 0603]
C21  4700 nF  [CAP ALUM 4.3MM2]
C22  100 nF  [CAP 0603]
D7  Red  [Blue LED 0603]
J4  Microphone  [CONN FEM HEADER 2PIN]
J5  Speaker  [CONN FEM HEADER 2PIN]
JP7  HEADER 6  [J\6P]
R16  4K7  [RES 0603]
R17  4K7  [RES 0603]
R18  4K7  [RES 0603]
R19  150  [RES 0603]
R20  80K6  [RES 0603]
R21  100K  [RES 0603]
R22  100K  [RES 0603]
S4  450405020524  [SL 3Pos Switch]
S5  KMR741NG ULC LFS  [Switch Lin SMD]
U5  Supplier Part Number 1: ISD1760SY-ND  [ISD1760SY]  (hidden comment: ISD1760SY)

### Nets
5V: C16.2 C17.1 C18.2 C19.1 C20.2 C21.1 D7.1 R16.2 R21.2 U5.1(VCCD) U5.14(VCCP) U5.21(VCCA)
GND: C12.2 C15.2 C16.1 C17.2 C18.1 C19.2 C20.1 C21.2 C22.1 R20.1 R22.1 S5.3 S5.4 U5.8(VSSA) U5.12(VSSP2) U5.16(VSSP1) U5.28(VSSD)
EN: U5.7(~{SS}) ; off-sheet EN
ERASE: JP7.3 U5.25(~{ERASE})
FT: JP7.6 U5.22(~{FT})
FWD: JP7.4 U5.26(~{FWD})
INT_READY: S4.3(COM) U5.27(~{INT}/RDY)
MISO: U5.4(MISO) ; off-sheet MISO
MOSI: U5.5(MOSI) ; off-sheet MOSI
PLAY: JP7.2 U5.23(~{PLAY})
REC: JP7.1 R18.2 U5.24(~{REC})
RST: C22.2 S5.1 S5.2 U5.3(~{RESET})
SCK: U5.6(SCLK) ; off-sheet SCK
VOL: JP7.5 U5.19(~{VOL})
NetC12_1: C12.1 R16.1 R17.2
NetC13_1: C13.1 U5.10(MIC+)
NetC13_2: C13.2 J4.1 R17.1
NetC14_1: C14.1 U5.11(MIC-)
NetC14_2: C14.2 J4.2 R18.1
NetC15_1: C15.1 U5.18(AGC)
NetD7_2: D7.2 R19.2
NetJ5_1: J5.1 U5.15(Sp+)
NetJ5_2: J5.2 U5.13(SP-)
NetR19_1: R19.1 U5.2(~{LED})
NetR20_2: R20.2 U5.20(ROSC)
NetR21_1: R21.1 S4.1
NetR22_2: R22.2 S4.2

Not connected (* = marked no-connect by the designer): U5 9(AnaIn)* 17(AUD/AUX)*

### Notes on the sheet
- 5- 2.2 = 2.8V
  2.8/ 0.020A = 140 OHM
  MAX mA = 20
- Titre :
- Conception :
- Date :
- Modification :
- Heure :
- Révision :
- Feuille
- de
- Fichier :

### Library data of the parts
C12 C15 = EMVE350ADA4R7MD55G: CAP ALUM 4.7UF 20% 35V SMD; manufacturer: United Chemi-Con; Lifetime @ Temp.: 1000 Hrs @ 105°C; Polarization: Polar; Ripple Current @ Low Frequency: 16 mA @ 120 Hz; Surface Mount Land Size: 0.169" L x 0.169" W (4.30mm x 4.30mm); Part Number: EMVE350ADA4R7MD55G; Applications: General Purpose; Capacitance: 4.7 µF; componentlink1description: Datasheet; componentlink1url: //media.digikey.com/pdf/Data%20Sheets/United%20Chemi-Con%20PDFs/MVE%20Series.pdf; componentlink2description: DigiKey Link; componentlink2url: https://www.digikey.com/en/products/detail/united-chemi-con/EMVE350ADA4R7MD55G/756875; Device Package: Radial, Can - SMD; Height - Seated (Max): 0.205" (5.20mm); lastupdated: 2023-04-04 19:53:03; Lifecycle Status: Active; Minimum Order: 1; Mounting Type: Surface Mount; Operating Temperature: -40°C ~ 105°C; Package / Case: Radial, Can - SMD; packaging: TapeAndReel; partid: 7039; Part Status: Active; price: 0.06; series: Alchip™- MVE; Size / Dimension: 0.157" Dia (4.00mm); Supplier 1: DigiKey; Supplier Part Number 1: 565-2229-1-ND; Tolerance: ±20%; value: 4.7 µF; Voltage - Rated: 35 V
C13 C14 C16 C18 C20 C22 = CS0603KRX7R7BB104: CAP CER 0.1UF 16V X7R 0603; manufacturer: Yageo; Capacitance: 0.1 µF; Tolerance: ±10%; Part Number: CS0603KRX7R7BB104; Value: 100 nF; Applications: Boardflex Sensitive; componentlink1description: Datasheet; componentlink1url: http://www.yageo.com/NewPortal/yageodocoutput?fileName=/pdf/MLCC/UPY-ST_NPOX7R_16V-to-3KV_5.pdf; componentlink2description: DigiKey Link; componentlink2url: https://www.digikey.com/en/products/detail/yageo/CS0603KRX7R7BB104/6097897; Device Package: 0603 (1608 Metric); Features: Soft Termination; lastupdated: 2023-04-02 19:09:22; Lifecycle Status: Active; Minimum Order: 1; Mounting Type: Surface Mount, MLCC; Operating Temperature: -55°C ~ 125°C; Package / Case: 0603 (1608 Metric); packaging: TapeAndReel; partid: 2286; Part Status: Active; price: 0.01; series: CS; Size / Dimension: 0.063" L x 0.031" W (1.60mm x 0.80mm); Supplier 1: DigiKey; Supplier Part Number 1: 311-3560-1-ND; Temperature Coefficient: X7R; Thickness (Max): 0.037" (0.95mm); Voltage - Rated: 16V
C17 C19 C21 = EMVE350ADA4R7MD55G: CAP ALUM 4.7UF 20% 35V SMD; manufacturer: United Chemi-Con; Capacitance: 4.7 µF; Lifetime @ Temp.: 1000 Hrs @ 105°C; Polarization: Polar; Ripple Current @ Low Frequency: 16 mA @ 120 Hz; Surface Mount Land Size: 0.169" L x 0.169" W (4.30mm x 4.30mm); value: 4.7 µF; Part Number: EMVE350ADA4R7MD55G; Applications: General Purpose; componentlink1description: Datasheet; componentlink1url: //media.digikey.com/pdf/Data%20Sheets/United%20Chemi-Con%20PDFs/MVE%20Series.pdf; componentlink2description: DigiKey Link; componentlink2url: https://www.digikey.com/en/products/detail/united-chemi-con/EMVE350ADA4R7MD55G/756875; Device Package: Radial, Can - SMD; Height - Seated (Max): 0.205" (5.20mm); lastupdated: 2023-04-04 19:53:03; Lifecycle Status: Active; Minimum Order: 1; Mounting Type: Surface Mount; Operating Temperature: -40°C ~ 105°C; Package / Case: Radial, Can - SMD; packaging: TapeAndReel; partid: 7039; Part Status: Active; price: 0.06; series: Alchip™- MVE; Size / Dimension: 0.157" Dia (4.00mm); Supplier 1: DigiKey; Supplier Part Number 1: 565-2229-1-ND; Tolerance: ±20%; Voltage - Rated: 35 V
D7 = BL-HUB36A-AV-TRB: 0603 RED; Manufacturer: American Bright Optoelectronics Corporation; Configuration: Standard; Current - Test: 20mA; Lens Color: Colorless; Lens Style: Rectangle with Flat Top; Lens Transparency: Clear; Millicandela Rating: 94mcd; Viewing Angle: 120°; Voltage - Forward (Vf) (Typ): 2.2V; Wavelength - Dominant: 632nm; Wavelength - Peak: 645nm; Part Number: BL-HUB36A-AV-TRB; Color: Red; ComponentLink1Description: Datasheet; ComponentLink1URL: https://americanbrightled.com/pdffiles/smt/BL-HUB36A-AV-TRB.pdf; ComponentLink2Description: DigiKey Link; ComponentLink2URL: https://www.digikey.com/en/products/detail/american-bright-optoelectronics-corporation/BL-HUB36A-AV-TRB/9678174; Device Package: 0603 (1608 Metric); Height (Max): 0.70mm; LastUpdated: 2023-03-27 19:53:19; Lifecycle Status: Active; Minimum Order: 1; Mounting Type: Surface Mount; Package / Case: 0603 (1608 Metric); Packaging: TapeAndReel; PartId: 1020; Part Status: Active; Price: 0.04; Series: -; Size / Dimension: 1.60mm L x 0.80mm W; Supplier 1: DigiKey; Supplier Part Number 1: BL-HUB36A-AV-TRBCT-ND; Supplier Device Package: 0603; Value: Red
J4 J5 = 282834-2: TERM BLK 2P SIDE ENT 2.54MM PCB; Manufacturer: TE Connectivity AMP Connectors; Current: 10A; Mating Orientation: Horizontal with Board; Number of Levels: 1; Pitch: 0.100" (2.54mm); Positions Per Level: 2; Voltage: 150V; Wire Gauge: 16-30 AWG; Wire Termination: Screw - Rising Cage Clamp; Part Number: 282834-2; Color: Green; ComponentLink1Description: Datasheet; ComponentLink1URL: https://www.te.com/commerce/DocumentDelivery/DDEController?Action=srchrtrv&DocNm=282834&DocType=Customer+Drawing&DocLang=English; ComponentLink2Description: DigiKey Link; ComponentLink2URL: http://digikey.com/product-detail/en/te-connectivity-amp-connectors/282834-2/A98333-ND/1150135; LastUpdated: 2020-01-15 04:15:38; Lifecycle Status: Active; Minimum Order: 1; Mounting Type: Through Hole; Packaging: Bulk; Part Status: Active; Price: 0.88; Series: Buchanan; Supplier 1: DigiKey; Supplier Part Number 1: A98333-ND
R16-R18 = RMCF0603FT4K70: RES 4.7K OHM 1% 1/10W 0603; Manufacturer: Stackpole Electronics Inc; Power (Watts): 0.1W, 1/10W; Resistance: 4.7 kOhms; Temperature Coefficient: ±100ppm/°C; Part Number: RMCF0603FT4K70; Value: 4K7; ComponentLink1Description: Datasheet; ComponentLink1URL: https://www.seielect.com/catalog/sei-rmcf_rmcp.pdf; ComponentLink2Description: DigiKey Link; ComponentLink2URL: https://www.digikey.com/en/products/detail/stackpole-electronics-inc/RMCF0603FT4K70/1760998; Composition: Thick Film; Device Package: 0603 (1608 Metric); Features: Automotive AEC-Q200; Height - Seated (Max): 0.022" (0.55mm); LastUpdated: 2023-04-04 19:29:43; Lifecycle Status: Active; Minimum Order: 1; Number of Terminations: 2; Operating Temperature: -55°C ~ 155°C; Package / Case: 0603 (1608 Metric); Packaging: CutTape; PartId: 6078; Part Status: Active; Price: 0.01; Ratings: AEC-Q200; Series: RMCF; Size / Dimension: 0.061" L x 0.031" W (1.55mm x 0.80mm); Supplier 1: DigiKey; Supplier Part Number 1: RMCF0603FT4K70CT-ND; Supplier Device Package: 0603; Tolerance: ±1%
R19 = MCT0603MD1500BP100: RES SMD 150 OHM 0.1% 1/8W 0603; Manufacturer: Vishay Beyschlag; Power (Watts): 0.125W, 1/8W; Resistance: 150 Ohms; Temperature Coefficient: ±25ppm/°C; Part Number: MCT0603MD1500BP100; Value: 150; ComponentLink1Description: Datasheet; ComponentLink1URL: http://www.vishay.com/docs/28785/mcat_pre.pdf; ComponentLink2Description: DigiKey Link; ComponentLink2URL: http://digikey.com/product-detail/en/vishay-beyschlag/MCT0603MD1500BP100/MCT0603-150-MBCT-ND/2092134; Composition: Thin Film; Device Package: 0603 (1608 Metric); Features: Anti-Sulfur, Automotive AEC-Q200; Height - Seated (Max): 0.022" (0.55mm); LastUpdated: 2023-04-04 19:29:46; Lifecycle Status: Active; Minimum Order: 1; Number of Terminations: 2; Operating Temperature: -55°C ~ 155°C; Package / Case: 0603 (1608 Metric); Packaging: TapeAndReel; PartId: 5246; Part Status: Active; Price: 0.23; Ratings: AEC-Q200; Series: MCT AT - Precision; Size / Dimension: 0.061" L x 0.033" W (1.55mm x 0.85mm); Supplier 1: DigiKey; Supplier Part Number 1: MCT0603-150-MBCT-ND; Supplier Device Package: 0603; Tolerance: ±0.1%
R20 = RCS060380K6FKEA: RES SMD 80.6K OHM 1% 1/4W 0603; Manufacturer: Vishay Dale; Power (Watts): 0.25W, 1/4W; Resistance: 80.6 kOhms; Temperature Coefficient: ±100ppm/°C; Part Number: RCS060380K6FKEA; Value: 80K6; ComponentLink1Description: Datasheet; ComponentLink1URL: https://www.vishay.com/docs/20065/rcse3.pdf; ComponentLink2Description: DigiKey Link; ComponentLink2URL: https://www.digikey.com/en/products/detail/vishay-dale/RCS060380K6FKEA/5868691; Composition: Thick Film; Device Package: 0603 (1608 Metric); Features: Automotive AEC-Q200, Pulse Withstanding; Height - Seated (Max): 0.020" (0.50mm); LastUpdated: 2023-04-04 19:27:58; Lifecycle Status: Active; Minimum Order: 1; Number of Terminations: 2; Operating Temperature: -55°C ~ 155°C; Package / Case: 0603 (1608 Metric); Packaging: TapeAndReel; PartId: 62631; Part Status: Active; Price: 0.02; Ratings: AEC-Q200; Series: RCS e3; Size / Dimension: 0.061" L x 0.033" W (1.55mm x 0.85mm); Supplier 1: DigiKey; Supplier Part Number 1: 541-RCS060380K6FKEACT-ND; Supplier Device Package: 0603; Tolerance: ±1%
R21 R22 = CMP0603AFX-1003ELF: RESHIGHPOWERA 0603 100K 1% 1/4W; Manufacturer: Bourns Inc.; Power (Watts): 0.25W, 1/4W; Resistance: 100 kOhms; Temperature Coefficient: ±100ppm/°C; Part Number: CMP0603AFX-1003ELF; Value: 100K; ComponentLink1Description: Datasheet; ComponentLink1URL: https://www.bourns.com/docs/Product-Datasheets/CMP-A.pdf; ComponentLink2Description: DigiKey Link; ComponentLink2URL: https://www.digikey.com/en/products/detail/bourns-inc/CMP0603AFX-1003ELF/12333642; Composition: Thick Film; Device Package: 0603 (1608 Metric); Features: Anti-Sulfur, Automotive AEC-Q200, Moisture Resistant, Pulse Withstanding; Height - Seated (Max): 0.022" (0.55mm); LastUpdated: 2023-04-04 19:28:10; Lifecycle Status: Active; Minimum Order: 1; Number of Terminations: 2; Operating Temperature: -55°C ~ 155°C; Package / Case: 0603 (1608 Metric); Packaging: TapeAndReel; PartId: 64150; Part Status: Active; Price: 0.03; Ratings: AEC-Q200; Series: CMP-A; Size / Dimension: 0.063" L x 0.031" W (1.60mm x 0.80mm); Supplier 1: DigiKey; Supplier Part Number 1: 118-CMP0603AFX-1003ELFCT-ND; Supplier Device Package: 0603; Tolerance: ±1%
S4 = 450405020524: SMT 8.7 X 3.0 MM MINI SLIDE SWIT; Manufacturer: Würth Elektronik; Rated Current: 300mA; Rated Voltage: 5VDC; Switching Function: On-On; Circuit: SPDT; Actuator Length: 2.00mm; Actuator Type: Standard; Contact Timing: Non-Shorting (BBM); Current Rating (Amps): 300mA (DC); Voltage Rating - DC: 5 V; ComponentLink1Description: Datasheet; ComponentLink1URL: https://www.we-online.com/catalog/datasheet/450405020524.pdf; ComponentLink2Description: DigiKey Link; ComponentLink2URL: https://www.digikey.com/en/products/detail/würth-elektronik/450405020524/11627297; Packaging: TapeAndReel; Publisher: Wurth Elektronik; Contact Material: Copper Alloy; Mounting Technology: SMT; Operating Temperature: -40°C ~ 85°C; Contact Plating: Silver; Part Number: 450405020524; Published Date: November 2019; Terminal Material: Copper Alloy; Size: 8.7x3mm; Terminal Plating: Silver; Contact Finish: Silver; LastUpdated: 2022-06-20 13:21:27; Lifecycle Status: Active; Minimum Order: 1; Mounting Type: Surface Mount; PartId: 4; Part Status: Active; Price: 0.73; Series: WS-SLSU; Supplier 1: DigiKey; Supplier Part Number 1: 732-450405020524CT-ND; Switch Function: On-On; Termination Style: SMD (SMT) Tab
S5 = KMR741NG ULC LFS: as S1 on sheet Sheet1; Part Number: KMR741NG ULC LFS; Circuit: SPST-NO; ComponentLink1Description: Datasheet; ComponentLink1URL: https://dznh3ojzb2azq.cloudfront.net/products/Tactile/KMR7/documents/datasheet.pdf; ComponentLink2Description: DigiKey Link; ComponentLink2URL: http://digikey.com/product-detail/en/c-k/KMR741NG-ULC-LFS/CKN10688CT-ND/6035360; LastUpdated: 2020-04-09 10:01:05; Lifecycle Status: Active; Minimum Order: 1; Mounting Type: Surface Mount; Operating Temperature: -40°C ~ 85°C; Packaging: TapeAndReel; Part Status: Active; Price: 0.16; Series: KMR7; Supplier 1: DigiKey; Supplier Part Number 1: CKN10688CT-ND; Termination Style: Gull Wing
U5 = ISD1760SY: Voice Record/Playback IC Multiple Message 40 ~ 120 Sec Pushbutton, SPI 28-SOIC; Manufacturer Part Number: ISD1760SY; Supplier 1: Digi-Key

## Nets that join several sheets
3.3V: Sheet1 (12 pins), Sheet2 (5 pins)
5V: Sheet1 (D1.2 JP1.5 JP1.6), Sheet2 (6 pins), Sheet3 (12 pins)
GND: Sheet1 (36 pins), Sheet2 (15 pins), Sheet3 (17 pins)
VUSB: Sheet1 (9 pins), Sheet2 (JP6.2)
A3_IO39: Sheet1 (U3.5), Sheet2 (JP4.9)
A4_IO36: Sheet1 (U3.4), Sheet2 (JP6.11)
BATLEVEL: Sheet1 (R1.1 R2.2), Sheet2 (U3.7)
EN: Sheet1 (R3.1 U1.3), Sheet2 (JP4.7), Sheet3 (U5.7)
GPIO0: Sheet1 (Q1.3), Sheet2 (U3.25)
MISO: Sheet2 (6 pins), Sheet3 (U5.4)
MOSI: Sheet2 (6 pins), Sheet3 (U5.5)
RESET: Sheet1 (6 pins), Sheet2 (JP4.8)
SCK: Sheet2 (6 pins), Sheet3 (U5.6)
STAYON: Sheet1 (R25.2), Sheet2 (U3.27)